# Altium schematic sheet Actuators_Schematic.SchDoc
size A; SheetNumber: 2; SheetTotal: 3
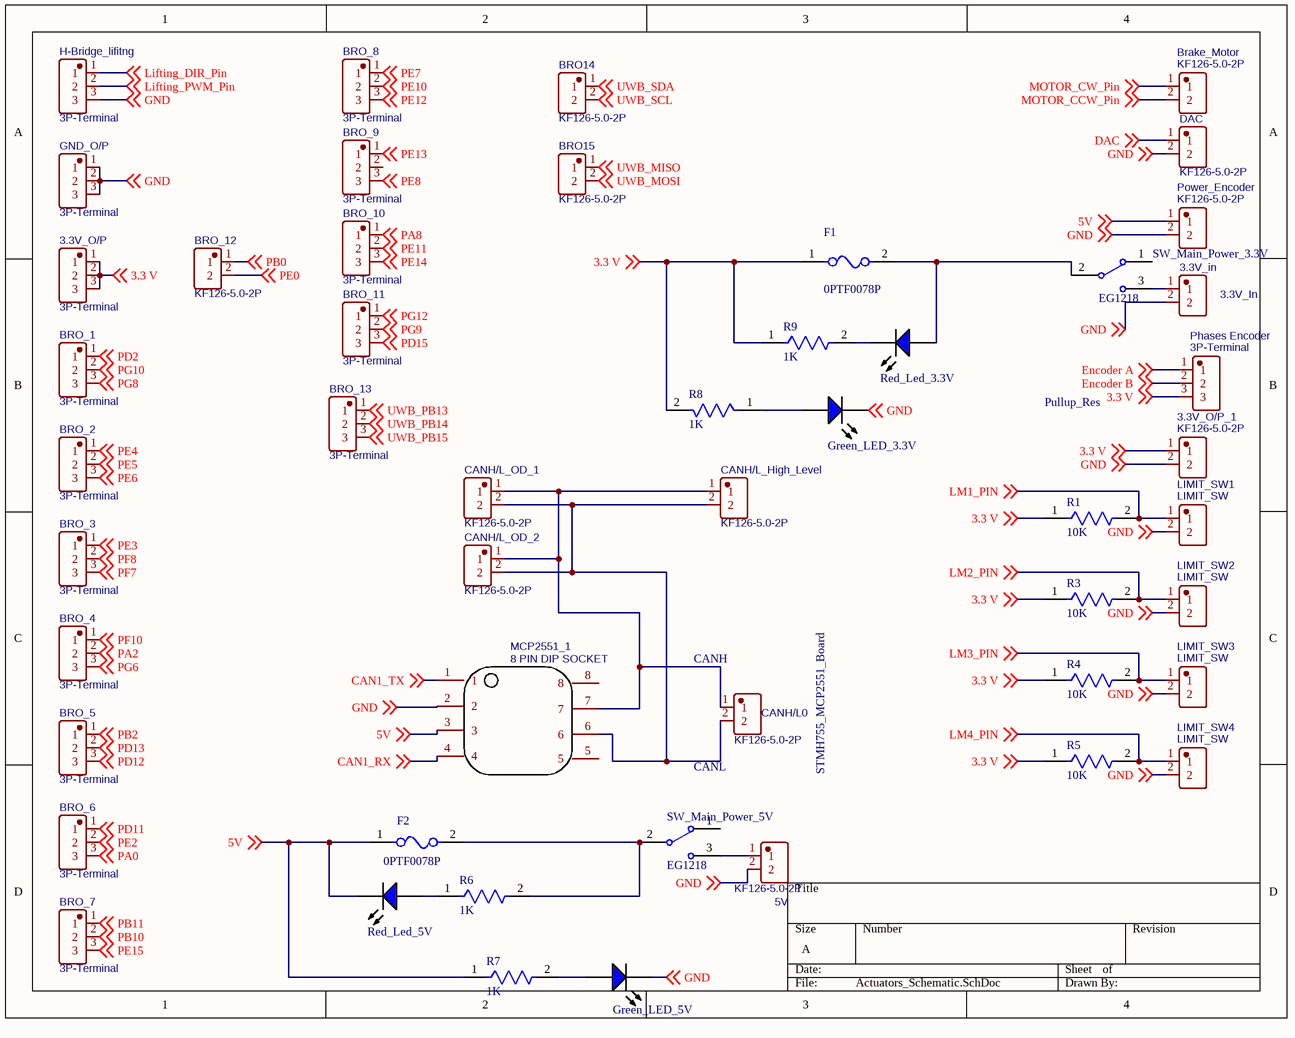
[diagram p0: Actuators_Schematic.SchDoc]

## Parts
3.3V_in  3.3V_In  [CONN-TH_P5.00_KF126-5.0-2P]
3.3V_O/P  3P-Terminal  [CONN-TH_3P-P5.00_KF126-5.0-3P]
3.3V_O/P_1  KF126-5.0-2P  [CONN-TH_P5.00_KF126-5.0-2P]
5V  KF126-5.0-2P  [CONN-TH_P5.00_KF126-5.0-2P]
Brake_Motor  KF126-5.0-2P  [CONN-TH_P5.00_KF126-5.0-2P]
BRO14  KF126-5.0-2P  [CONN-TH_P5.00_KF126-5.0-2P]
BRO15  KF126-5.0-2P  [CONN-TH_P5.00_KF126-5.0-2P]
BRO_1  3P-Terminal  [CONN-TH_3P-P5.00_KF126-5.0-3P]
BRO_2  3P-Terminal  [CONN-TH_3P-P5.00_KF126-5.0-3P]
BRO_3  3P-Terminal  [CONN-TH_3P-P5.00_KF126-5.0-3P]
BRO_4  3P-Terminal  [CONN-TH_3P-P5.00_KF126-5.0-3P]
BRO_5  3P-Terminal  [CONN-TH_3P-P5.00_KF126-5.0-3P]
BRO_6  3P-Terminal  [CONN-TH_3P-P5.00_KF126-5.0-3P]
BRO_7  3P-Terminal  [CONN-TH_3P-P5.00_KF126-5.0-3P]
BRO_8  3P-Terminal  [CONN-TH_3P-P5.00_KF126-5.0-3P]
BRO_9  3P-Terminal  [CONN-TH_3P-P5.00_KF126-5.0-3P]
BRO_10  3P-Terminal  [CONN-TH_3P-P5.00_KF126-5.0-3P]
BRO_11  3P-Terminal  [CONN-TH_3P-P5.00_KF126-5.0-3P]
BRO_12  KF126-5.0-2P  [CONN-TH_P5.00_KF126-5.0-2P]
BRO_13  3P-Terminal  [CONN-TH_3P-P5.00_KF126-5.0-3P]
CANH/L0  KF126-5.0-2P  [CONN-TH_P5.00_KF126-5.0-2P]
CANH/L_High_Level  KF126-5.0-2P  [CONN-TH_P5.00_KF126-5.0-2P]
CANH/L_OD_1  KF126-5.0-2P  [CONN-TH_P5.00_KF126-5.0-2P]
CANH/L_OD_2  KF126-5.0-2P  [CONN-TH_P5.00_KF126-5.0-2P]
DAC  KF126-5.0-2P  [CONN-TH_P5.00_KF126-5.0-2P]
F1  0PTF0078P  [FP-0PTF0078P-MFG]
F2  0PTF0078P  [FP-0PTF0078P-MFG]
GND_O/P  3P-Terminal  [CONN-TH_3P-P5.00_KF126-5.0-3P]
Green_LED_3.3V  WP710A10QBC/D  [KING-WP710A10QBCD_V]  (value not drawn)
Green_LED_5V  WP710A10QBC/D  [KING-WP710A10QBCD_V]  (value not drawn)
H-Bridge_lifitng  3P-Terminal  [CONN-TH_3P-P5.00_KF126-5.0-3P]
LIMIT_SW1  LIMIT_SW  [CONN-TH_P5.00_KF126-5.0-2P]
LIMIT_SW2  LIMIT_SW  [CONN-TH_P5.00_KF126-5.0-2P]
LIMIT_SW3  LIMIT_SW  [CONN-TH_P5.00_KF126-5.0-2P]
LIMIT_SW4  LIMIT_SW  [CONN-TH_P5.00_KF126-5.0-2P]
MCP2551_1  8 PIN DIP SOCKET  [DIP 8 PIN SOCKET]
Phases_Encoder  3P-Terminal  [CONN-TH_3P-P5.00_KF126-5.0-3P]
Power_Encoder  KF126-5.0-2P  [CONN-TH_P5.00_KF126-5.0-2P]
R1  10K  [FP-MFR-12-MFG]
R3  10K  [FP-MFR-12-MFG]
R4  10K  [FP-MFR-12-MFG]
R5  10K  [FP-MFR-12-MFG]
R6  1K  [FP-MFR-12-MFG]
R7  1K  [FP-MFR-12-MFG]
R8  1K  [FP-MFR-12-MFG]
R9  1K  [FP-MFR-12-MFG]
Red_Led_3.3V  WP710A10QBC/D  [KING-WP710A10QBCD_V]  (value not drawn)
Red_Led_5V  WP710A10QBC/D  [KING-WP710A10QBCD_V]  (value not drawn)
SW_Main_Power_3.3V  EG1218  [ESWI-EG1218_V]
SW_Main_Power_5V  EG1218  [ESWI-EG1218_V]

## Nets
3.3 V: 3.3V_O/P.1 3.3V_O/P.2 3.3V_O/P.3 3.3V_O/P_1.1 F1.1 Phases_Encoder.3 R1.1 R3.1 R4.1 R5.1 R8.2 R9.1 ; off-sheet 3.3 V
5V: F2.1 MCP2551_1.3 Power_Encoder.1 R7.1 Red_Led_5V.2(K) ; off-sheet 5V
CAN1_RX: MCP2551_1.4 ; off-sheet CAN1_RX
CAN1_TX: MCP2551_1.1 ; off-sheet CAN1_TX
DAC: DAC.1 ; off-sheet DAC
Encoder A: Phases_Encoder.1 ; off-sheet Encoder A
Encoder B: Phases_Encoder.2 ; off-sheet Encoder B
GND: 3.3V_in.2 3.3V_O/P_1.2 5V.2 DAC.2 GND_O/P.1 GND_O/P.2 GND_O/P.3 Green_LED_3.3V.2(K) Green_LED_5V.2(K) H-Bridge_lifitng.3 LIMIT_SW1.2 LIMIT_SW2.2 LIMIT_SW3.2 LIMIT_SW4.2 MCP2551_1.2 Power_Encoder.2 ; off-sheet GND
Lifting_DIR_Pin: H-Bridge_lifitng.1 ; off-sheet Lifting_DIR_Pin
Lifting_PWM_Pin: H-Bridge_lifitng.2 ; off-sheet Lifting_PWM_Pin
LM1_PIN: LIMIT_SW1.1 R1.2 ; off-sheet LM1_PIN
LM2_PIN: LIMIT_SW2.1 R3.2 ; off-sheet LM2_PIN
LM3_PIN: LIMIT_SW3.1 R4.2 ; off-sheet LM3_PIN
LM4_PIN: LIMIT_SW4.1 R5.2 ; off-sheet LM4_PIN
MOTOR_CCW_Pin: Brake_Motor.2 ; off-sheet MOTOR_CCW_Pin
MOTOR_CW_Pin: Brake_Motor.1 ; off-sheet MOTOR_CW_Pin
PA0: BRO_6.3 ; off-sheet PA0
PA2: BRO_4.2 ; off-sheet PA2
PA8: BRO_10.1 ; off-sheet PA8
PB0: BRO_12.1 ; off-sheet PB0
PB2: BRO_5.1 ; off-sheet PB2
PB10: BRO_7.2 ; off-sheet PB10
PB11: BRO_7.1 ; off-sheet PB11
PD2: BRO_1.1 ; off-sheet PD2
PD11: BRO_6.1 ; off-sheet PD11
PD12: BRO_5.3 ; off-sheet PD12
PD13: BRO_5.2 ; off-sheet PD13
PD15: BRO_11.3 ; off-sheet PD15
PE0: BRO_12.2 ; off-sheet PE0
PE2: BRO_6.2 ; off-sheet PE2
PE3: BRO_3.1 ; off-sheet PE3
PE4: BRO_2.1 ; off-sheet PE4
PE5: BRO_2.2 ; off-sheet PE5
PE6: BRO_2.3 ; off-sheet PE6
PE7: BRO_8.1 ; off-sheet PE7
PE8: BRO_9.3 ; off-sheet PE8
PE10: BRO_8.2 ; off-sheet PE10
PE11: BRO_10.2 ; off-sheet PE11
PE12: BRO_8.3 ; off-sheet PE12
PE13: BRO_9.1 ; off-sheet PE13
PE14: BRO_10.3 ; off-sheet PE14
PE15: BRO_7.3 ; off-sheet PE15
PF7: BRO_3.3 ; off-sheet PF7
PF8: BRO_3.2 ; off-sheet PF8
PF10: BRO_4.1 ; off-sheet PF10
PG6: BRO_4.3 ; off-sheet PG6
PG8: BRO_1.3 ; off-sheet PG8
PG9: BRO_11.2 ; off-sheet PG9
PG10: BRO_1.2 ; off-sheet PG10
PG12: BRO_11.1 ; off-sheet PG12
UWB_MISO: BRO15.1 ; off-sheet UWB_MISO
UWB_MOSI: BRO15.2 ; off-sheet UWB_MOSI
UWB_PB13: BRO_13.1 ; off-sheet UWB_PB13
UWB_PB14: BRO_13.2 ; off-sheet UWB_PB14
UWB_PB15: BRO_13.3 ; off-sheet UWB_PB15
UWB_SCL: BRO14.2 ; off-sheet UWB_SCL
UWB_SDA: BRO14.1 ; off-sheet UWB_SDA
Net3.3V_in_1: 3.3V_in.1 SW_Main_Power_3.3V.3
Net5V_1: 5V.1 SW_Main_Power_5V.3
NetCANH/L0_1: CANH/L0.1 CANH/L_High_Level.1 CANH/L_OD_1.1 CANH/L_OD_2.1 MCP2551_1.7
NetCANH/L0_2: CANH/L0.2 CANH/L_High_Level.2 CANH/L_OD_1.2 CANH/L_OD_2.2 MCP2551_1.6
NetF1_2: F1.2 Red_Led_3.3V.1(A) SW_Main_Power_3.3V.2(COM)
NetF2_2: F2.2 R6.2 SW_Main_Power_5V.2(COM)
NetGreen_LED_3.3V_1: Green_LED_3.3V.1(A) R8.1
NetGreen_LED_5V_1: Green_LED_5V.1(A) R7.2
NetR6_1: R6.1 Red_Led_5V.1(A)
NetR9_2: R9.2 Red_Led_3.3V.2(K)

Not connected (* = marked no-connect by the designer): BRO_9 2; MCP2551_1 5 8; SW_Main_Power_3.3V 1; SW_Main_Power_5V 1

## Notes on the sheet
- Pullup_Res
- (near CANH/L0) CANH
- CANL
- STMH755_MCP2551_Board

## Library data of the parts
3.3V_in 3.3V_O/P_1 5V Brake_Motor BRO14 BRO15 BRO_12 CANH/L0 CANH/L_High_Level CANH/L_OD_1 CANH/L_OD_2 DAC LIMIT_SW1-LIMIT_SW4 Power_Encoder = KF126-5.0-2P: Manufacturer: Cixi Kefa Elec; Contributor: LCSC; Supplier: LCSC; Supplier Part: C474900; Manufacturer Part: KF126-5.0-2P; spicePre: P; spiceSymbolName: KF126-5.0-2P
3.3V_O/P BRO_1-BRO_11 BRO_13 GND_O/P H-Bridge_lifitng Phases_Encoder = Limit Switch: Manufacturer: Cixi Kefa Elec; Manufacturer Part: KF126-5.0-3P; Contributor: thulasikrishna; Supplier: LCSC; Supplier Part: C474901; JLCPCB Part Class: Extended Part; spicePre: U; spiceSymbolName: KF126-5.0-3P
F1 F2 = CMP-08604-000023-1: FUSE BLOCK CARTRIDGE PCB; Manufacturer: Littelfuse Inc; Number Of Fuses: 1; Conn Orientation: Vertical; Fuse Current: 6.3A; Voltage Rating Ac: 250V; Package: 0; Ambient Temperature Range Low: -30°C; ComponentLink2URL: https://media.digikey.com/pdf/Data%20Sheets/Littelfuse%20PDFs/PTF075_77_78.pdf; Device Class L3: unset; Lead Free: Yes; Device Class L1: Circuit Protection; RoHS: TRUE; Manufacturer Part Number: 0PTF0078P; Ambient Temperature Range High: +85°C; Category: Fuse; Octopart: https://octopart.com/0ptf0078p-littelfuse-13255855; Digikey Description: FUSE BLOCK CARTRIDGE PCB; Height: 11.5mm; ComponentLink2Description: Datasheet; Device Class L2: Fuse Holders; Mouser Description: Fuse Holder 5X20MM Pitch 22/7 UL94V0 Open; Automotive: No; Voltage Rating Dc: 250V
Green_LED_3.3V Green_LED_5V Red_Led_3.3V Red_Led_5V = CMP-2000-07416-1: Blue LED, 3.3 V, 20 mA, -40 to 85 degC, 2-Pin THD, RoHS, Bulk; Manufacturer: Kingbright; Forward Current: 20mA; LED Size: T-1; Viewing Angle: 20deg; Lens Color/Style: WaterClear; Wavelength/Color Temperature: 470nm; Forward Voltage: 3.3V; Luminous Intensity: 1600mcd; Lens Shape: Dome; Minimum Operating Temperature: -40C; Package Description: 2-Pin Through Hole Device, Dia 3.2 mm; Packaging: Bulk; Maximum Operating Temperature: +85C; Factory Pack Quantity: 500; Mounting Technology: ThroughHole; Datasheet URL: https://datasheet.ciiva.com/2121/wp710a10qbc-d-2121617.pdf; Datasheet Version: Rev. 5B, 09/2014; Type: SolidStateLEDLamp; Package Reference: WP710A10QBCD; Lens Dimensions: 3mmx4.6mm; Product Category: StandardLEDs-ThroughHole; Manufacturer URL: http://www.kingbright.com/; Mounting Style: ThroughHole; RoHS: Details; Illumination Color: Blue
MCP2551_1 = 8 PIN DIP SOCKET: Contributor: uniqengineeringworks; Supplier: LCSC; spicePre: U; spiceSymbolName: 8 PIN DIP SOCKET
R1 R3-R9 = CMP-03413-000012-1: RES MF 1/6W 1% AXIAL; Power Rating: 160mW; Voltage Rating (DC): 200V; Resistance: 10kR; Min Operating Temperature: -55°C; Max Operating Temperature: 155°C; Voltage Rating: 200V; Termination: Axial; Packaging: Ammo Pack; Tolerance: 1%
SW_Main_Power_3.3V SW_Main_Power_5V = CMP-1696-00002-1: Slide Switch, 500 V, -20 to 70 degC, 3-Pin THD, RoHS; Case\Package: SOT-23-5; Output Current: 150 mA; Nominal Output Voltage: 3.3 V; Max Power Dissipation: 250 mW; Min Input Voltage: 4.3 V; Outputs: 1; Max Input Voltage: 8 V; Dropout Voltage: 300 mV; PackageDescription: 3-Pin Through Hole Device, Body 11.6 x 4 mm, Pitch 2.5 mm; ComponentLink1URL: http://www.e-switch.ch/en/; RoHSCompliant: true; Length: 3 mm; ComponentLink1Description: Manufacturer URL; Power Rating: 250 mW; Mount: Surface Mount; Max Operating Temperature: 85 degC; REACH SVHC: No SVHC; Radiation Hardening: No; Height: 1.3 mm; Pins: 5; Max Ouput Current: 150 mA; Output Voltage: 3.3 V; Width: 1.8 mm; Package Quantity: 3000; ComponentLink2URL: https://www.e-switch.com/system/asset/product_line/data_sheet/119/EG.pdf; Min Operating Temperature: -40 degC; ComponentLink2Description: Datasheet; DatasheetVersion: Oct-15; PackageReference: EG1218; Packaging: Tape and Reel